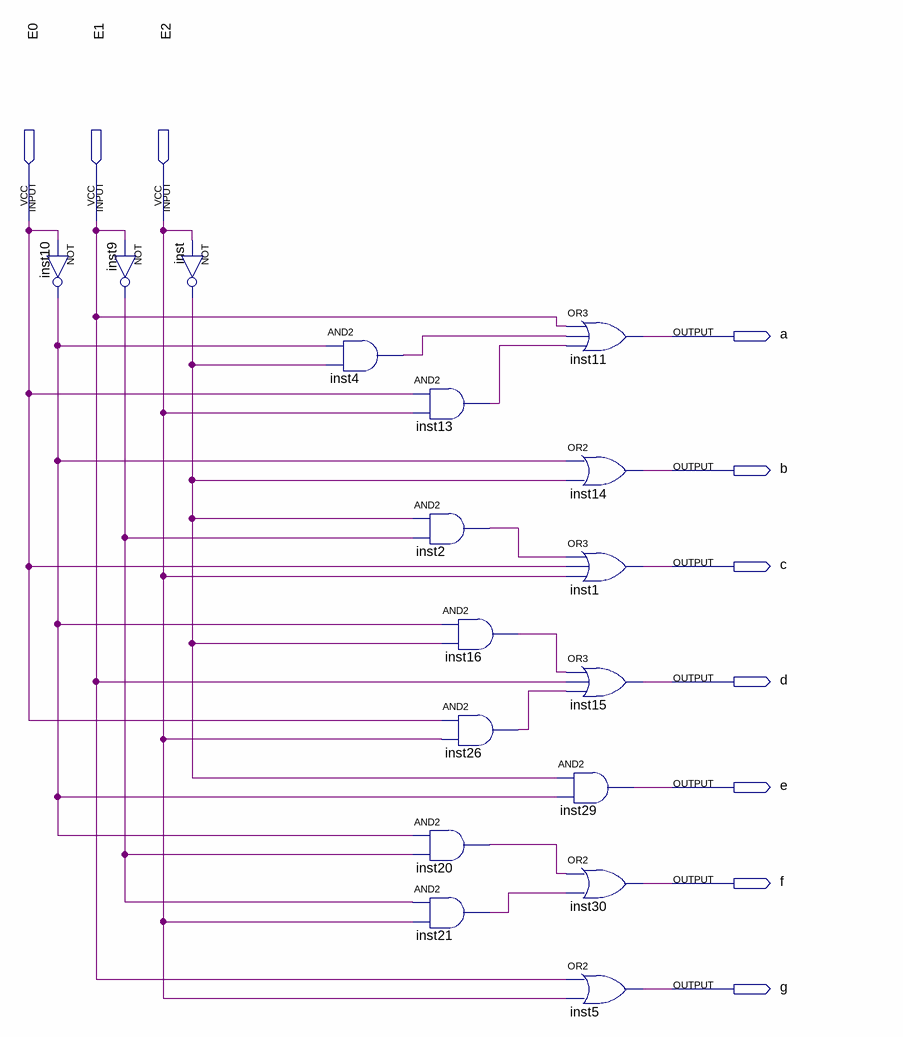
[diagram p0: schematic sheet]
// Quartus schematic BCD3.bdf as structural Verilog: 17 symbols, 10 pins
module BCD3 (
  input  E0,
  input  E1,
  input  E2,
  output a,
  output b,
  output c,
  output d,
  output e,
  output f,
  output g
);

  wire inst2_out, inst4_out, inst9_out, inst10_out, inst13_out, inst16_out, inst20_out, inst21_out,
       inst26_out, inst_out;

  not inst10 (inst10_out, E0);
  not inst9 (inst9_out, E1);
  not inst (inst_out, E2);
  and inst4 (inst4_out, inst10_out, inst_out);
  and inst13 (inst13_out, E0, E2);
  and inst2 (inst2_out, inst_out, inst9_out);
  and inst20 (inst20_out, inst10_out, inst9_out);
  and inst21 (inst21_out, inst9_out, E2);
  and inst16 (inst16_out, inst10_out, inst_out);
  and inst26 (inst26_out, E0, E2);
  or inst11 (a, E1, inst4_out, inst13_out);
  or inst14 (b, inst10_out, inst_out);
  or inst1 (c, inst2_out, E0, E2);
  or inst15 (d, inst16_out, E1, inst26_out);
  and inst29 (e, inst_out, inst10_out);
  or inst30 (f, inst20_out, inst21_out);
  or inst5 (g, E1, E2);
endmodule
